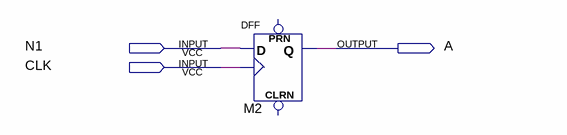
[diagram p0: schematic sheet]
// Quartus schematic maquina_2.bdf as structural Verilog: 1 symbols, 3 pins
module maquina_2 (
  input  N1,
  input  CLK,
  output A
);

  DFF M2 (.CLK(CLK), .D(N1), .Q(A));  // open: CLRN, PRN
endmodule
